# Altium project SimpleWatch.PrjPCB
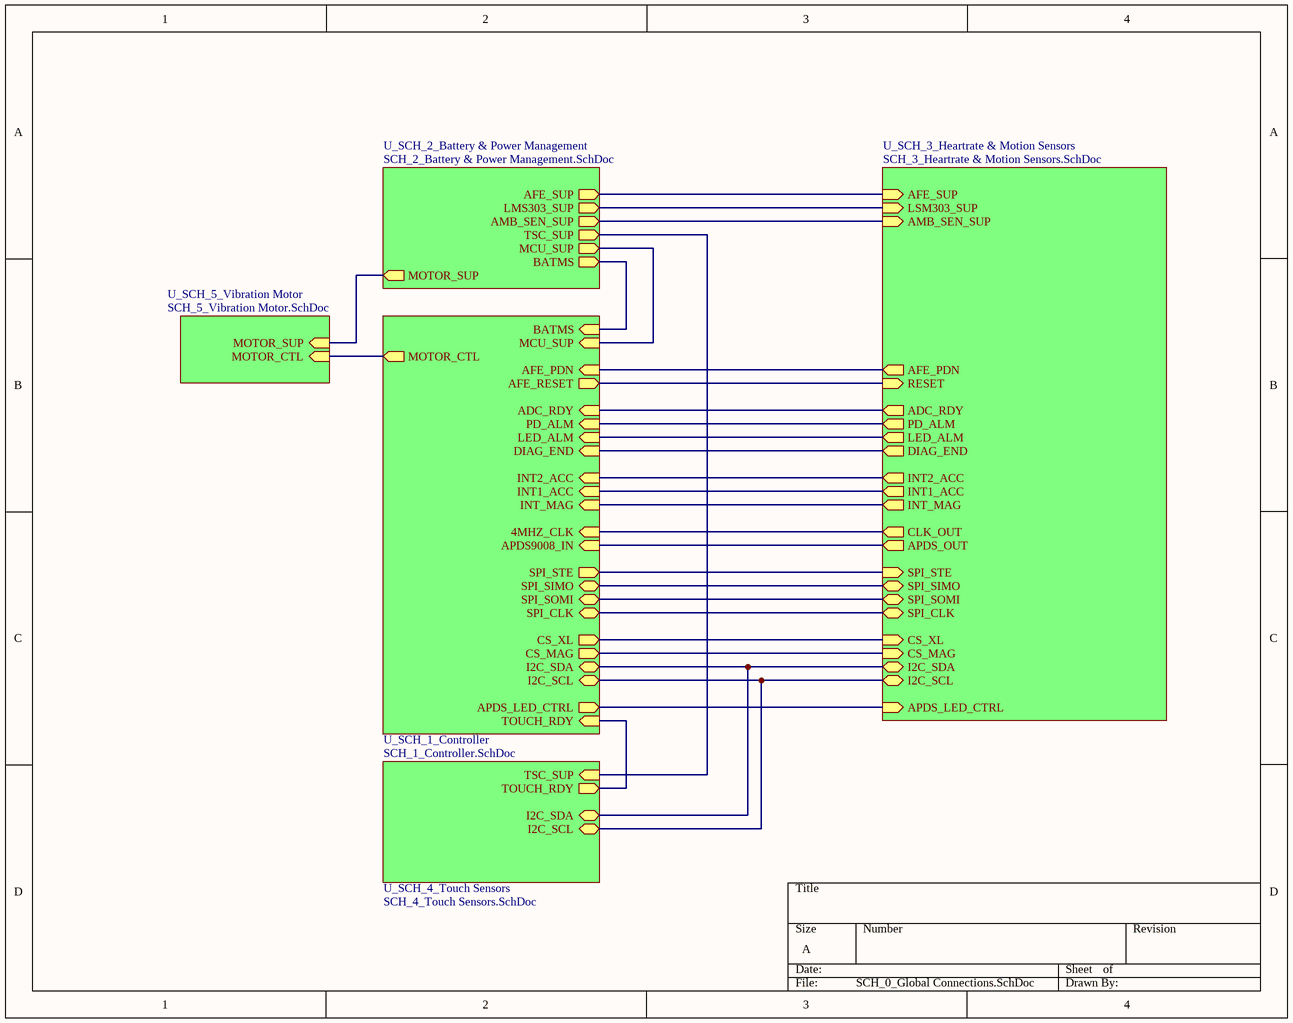
[diagram p0: SCH_0_Global Connections.SchDoc]
6 sheets, 125 parts. Net scope: hierarchical (ports join the sheet entries above them; power ports are global).
Board file: Simple Watch Development Board.PcbDoc
Sheets:
  SCH_0_Global Connections.SchDoc
    U_SCH_3_Heartrate & Motion Sensors = SCH_3_Heartrate & Motion Sensors.SchDoc
    U_SCH_2_Battery & Power Management = SCH_2_Battery & Power Management.SchDoc
    U_SCH_1_Controller = SCH_1_Controller.SchDoc
    U_SCH_4_Touch Sensors = SCH_4_Touch Sensors.SchDoc
    U_SCH_5_Vibration Motor = SCH_5_Vibration Motor.SchDoc

## Sheet SCH_0_Global Connections.SchDoc
size A

### Sub-sheets
U_SCH_1_Controller = SCH_1_Controller.SchDoc: MCU_SUP (in), ADC_RDY (in), PD_ALM (in), LED_ALM (in), DIAG_END (in), AFE_RESET (out), INT_MAG (in), INT2_ACC (in), INT1_ACC (in), 4MHZ_CLK (in), APDS9008_IN (in), SPI_STE (out), SPI_SIMO (bidir), SPI_SOMI (bidir), SPI_CLK (bidir), CS_XL (out), CS_MAG (out), I2C_SDA (bidir), I2C_SCL (bidir), BATMS (in), TOUCH_RDY (in), APDS_LED_CTRL (out), AFE_PDN (in), MOTOR_CTL (out)
U_SCH_2_Battery & Power Management = SCH_2_Battery & Power Management.SchDoc: LMS303_SUP (out), AMB_SEN_SUP (out), MCU_SUP (out), BATMS (out), AFE_SUP (out), MOTOR_SUP (out), TSC_SUP (out)
U_SCH_3_Heartrate & Motion Sensors = SCH_3_Heartrate & Motion Sensors.SchDoc: CLK_OUT (out), RESET (in), ADC_RDY (out), SPI_STE (in), SPI_SIMO (bidir), SPI_SOMI (bidir), SPI_CLK (bidir), PD_ALM (out), LED_ALM (out), DIAG_END (out), INT_MAG (out), INT2_ACC (out), INT1_ACC (out), CS_XL (in), CS_MAG (in), I2C_SDA (bidir), I2C_SCL (bidir), APDS_OUT (out), LSM303_SUP (in), AMB_SEN_SUP (in), AFE_SUP (in), APDS_LED_CTRL (in), AFE_PDN (out)
U_SCH_4_Touch Sensors = SCH_4_Touch Sensors.SchDoc: TOUCH_RDY (out), I2C_SDA (bidir), I2C_SCL (bidir), TSC_SUP (in)
U_SCH_5_Vibration Motor = SCH_5_Vibration Motor.SchDoc: MOTOR_CTL (in), MOTOR_SUP (in)

### Nets
APDS_SUP: sheet U_SCH_3_Heartrate & Motion Sensors/AMB_SEN_SUP, sheet U_SCH_2_Battery & Power Management/AMB_SEN_SUP
LED_DRV_SUP: sheet U_SCH_3_Heartrate & Motion Sensors/AFE_SUP, sheet U_SCH_2_Battery & Power Management/AFE_SUP
LSM303_SUP: sheet U_SCH_3_Heartrate & Motion Sensors/LSM303_SUP, sheet U_SCH_2_Battery & Power Management/LMS303_SUP
MCU_SUP: sheet U_SCH_2_Battery & Power Management/MCU_SUP, sheet U_SCH_1_Controller/MCU_SUP
AFE_PDN: sheet U_SCH_3_Heartrate & Motion Sensors/AFE_PDN, sheet U_SCH_1_Controller/AFE_PDN
AFE_RST: sheet U_SCH_3_Heartrate & Motion Sensors/RESET, sheet U_SCH_1_Controller/AFE_RESET
APDS_LED: sheet U_SCH_3_Heartrate & Motion Sensors/APDS_LED_CTRL, sheet U_SCH_1_Controller/APDS_LED_CTRL
CS_AFE: sheet U_SCH_3_Heartrate & Motion Sensors/SPI_STE, sheet U_SCH_1_Controller/SPI_STE
CS_MAG: sheet U_SCH_3_Heartrate & Motion Sensors/CS_MAG, sheet U_SCH_1_Controller/CS_MAG
CS_XL: sheet U_SCH_3_Heartrate & Motion Sensors/CS_XL, sheet U_SCH_1_Controller/CS_XL
I2C1_SCL: sheet U_SCH_3_Heartrate & Motion Sensors/I2C_SCL, sheet U_SCH_1_Controller/I2C_SCL, sheet U_SCH_4_Touch Sensors/I2C_SCL
I2C1_SDA: sheet U_SCH_3_Heartrate & Motion Sensors/I2C_SDA, sheet U_SCH_1_Controller/I2C_SDA, sheet U_SCH_4_Touch Sensors/I2C_SDA
INT1_ACC: sheet U_SCH_3_Heartrate & Motion Sensors/INT1_ACC, sheet U_SCH_1_Controller/INT1_ACC
INT2_ACC: sheet U_SCH_3_Heartrate & Motion Sensors/INT2_ACC, sheet U_SCH_1_Controller/INT2_ACC
MOTOR: sheet U_SCH_1_Controller/MOTOR_CTL, sheet U_SCH_5_Vibration Motor/MOTOR_CTL
MOTOR_SUP: sheet U_SCH_2_Battery & Power Management/MOTOR_SUP, sheet U_SCH_5_Vibration Motor/MOTOR_SUP
OPAMP1_VINP: sheet U_SCH_3_Heartrate & Motion Sensors/APDS_OUT, sheet U_SCH_1_Controller/APDS9008_IN
SPI1_MISO: sheet U_SCH_3_Heartrate & Motion Sensors/SPI_SOMI, sheet U_SCH_1_Controller/SPI_SOMI
SPI1_MOSI: sheet U_SCH_3_Heartrate & Motion Sensors/SPI_SIMO, sheet U_SCH_1_Controller/SPI_SIMO
SPI1_SCK: sheet U_SCH_3_Heartrate & Motion Sensors/SPI_CLK, sheet U_SCH_1_Controller/SPI_CLK
TOUCH_RDY: sheet U_SCH_1_Controller/TOUCH_RDY, sheet U_SCH_4_Touch Sensors/TOUCH_RDY
TSC_SUP: sheet U_SCH_2_Battery & Power Management/TSC_SUP, sheet U_SCH_4_Touch Sensors/TSC_SUP
NetR11_1: sheet U_SCH_3_Heartrate & Motion Sensors/CLK_OUT, sheet U_SCH_1_Controller/4MHZ_CLK
NetR12_1: sheet U_SCH_2_Battery & Power Management/BATMS, sheet U_SCH_1_Controller/BATMS
NetU11_4: sheet U_SCH_3_Heartrate & Motion Sensors/DIAG_END, sheet U_SCH_1_Controller/DIAG_END
NetU11_14: sheet U_SCH_3_Heartrate & Motion Sensors/ADC_RDY, sheet U_SCH_1_Controller/ADC_RDY
NetU11_21: sheet U_SCH_3_Heartrate & Motion Sensors/PD_ALM, sheet U_SCH_1_Controller/PD_ALM
NetU11_22: sheet U_SCH_3_Heartrate & Motion Sensors/LED_ALM, sheet U_SCH_1_Controller/LED_ALM
NetU11_38: sheet U_SCH_3_Heartrate & Motion Sensors/INT_MAG, sheet U_SCH_1_Controller/INT_MAG

## Sheet SCH_3_Heartrate & Motion Sensors.SchDoc
size B
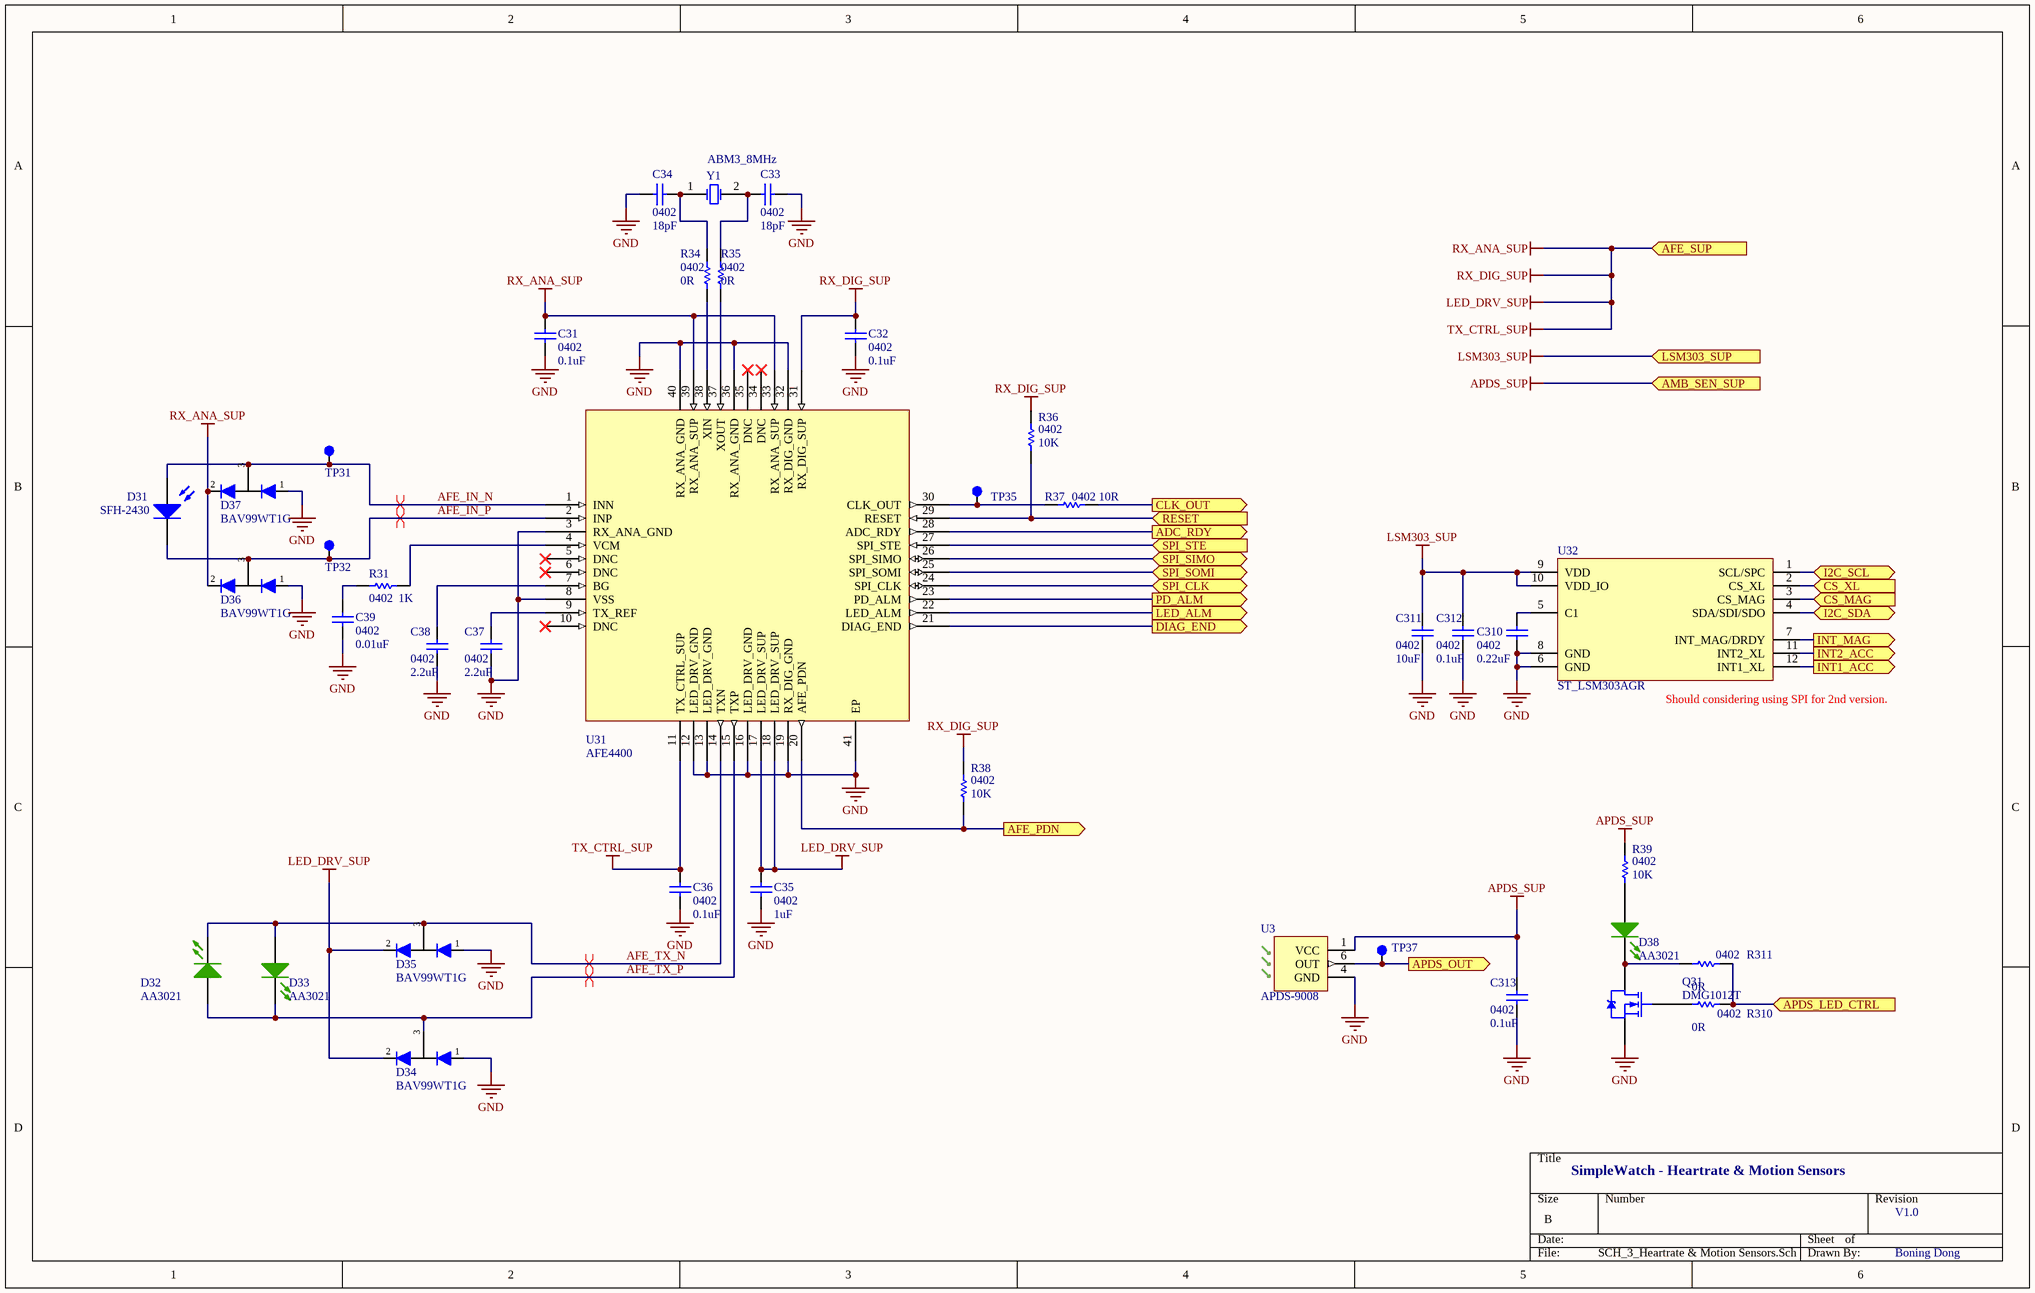
[diagram p1: SCH_3_Heartrate & Motion Sensors.SchDoc]

### Parts
C31  0402  value 0.1uF  [CAPC1005X07N]
C32  0402  value 0.1uF  [CAPC1005X07N]
C33  0402  value 18pF  [CAPC1005X07N]
C34  0402  value 18pF  [CAPC1005X07N]
C35  0402  value 1uF  [CAPC1005X07N]
C36  0402  value 0.1uF  [CAPC1005X07N]
C37  0402  value 2.2uF  [CAPC1005X07N]
C38  0402  value 2.2uF  [CAPC1005X07N]
C39  0402  value 0.01uF  [CAPC1005X07N]
C310  0402  value 0.22uF  [CAPC1005X07N]
C311  0402  value 10uF  [CAPC1005X07N]
C312  0402  value 0.1uF  [CAPC1005X07N]
C313  0402  value 0.1uF  [CAPC1005X07N]
D31  SFH-2430  [PHOTODIODE_OSRAM_SFH_2430]
D32  AA3021  [LED_KINGBRIGHT_AA3021]
D33  AA3021  [LED_KINGBRIGHT_AA3021]
D34  BAV99WT1G  [SOT65P200X125X90-3N]
D35  BAV99WT1G  [SOT65P200X125X90-3N]
D36  BAV99WT1G  [SOT65P200X125X90-3N]
D37  BAV99WT1G  [SOT65P200X125X90-3N]
D38  AA3021  [LED_KINGBRIGHT_AA3021]
Q31  DMG1012T  [SOT65P200X125X95-3N]
R31  0402  value 1K  [RESC1005X04N]
R34  0402  value 0R  [RESC1005X04N]
R35  0402  value 0R  [RESC1005X04N]
R36  0402  value 10K  [RESC1005X04N]
R37  0402  value 10R  [RESC1005X04N]
R38  0402  value 10K  [RESC1005X04N]
R39  0402  value 10K  [RESC1005X04N]
R310  0402  value 0R  [RESC1005X04N]
R311  0402  value 0R  [RESC1005X04N]
TP31  TP  [TP100]  (value not drawn)
TP32  TP  [TP100]  (value not drawn)
TP35  TP  [TP100]  (value not drawn)
TP37  TP  [TP100]  (value not drawn)
U3  APDS-9008  [APDS-9008]
U31  AFE4400  [QFN50P600X600X100-40N_HS410]
U32  ST_LSM303AGR  [LGA12S50P4X4_200X200X100]
Y1  ABM3_8MHz  [ABRACON_ABM3]

### Ports
ADC_RDY (out), AFE_PDN (out), AFE_SUP (in), AMB_SEN_SUP (in), APDS_LED_CTRL (in), APDS_OUT (out), CLK_OUT (out), CS_MAG (in), CS_XL (in), DIAG_END (out), I2C_SCL (bidir), I2C_SDA (bidir), INT1_ACC (out), INT2_ACC (out), INT_MAG (out), LED_ALM (out), LSM303_SUP (in), PD_ALM (out), RESET (in), SPI_CLK (bidir), SPI_SIMO (bidir), SPI_SOMI (bidir), SPI_STE (in)

### Nets
APDS_SUP: C313.2 R39.2 U3.1(VCC) ; port AMB_SEN_SUP
GND: C31.1 C32.1 C33.1 C34.2 C35.1 C36.1 C37.1 C38.1 C39.1 C310.1 C311.1 C312.1 C313.1 D34.1(ANODE) D35.1(ANODE) D36.1(ANODE) D37.1(ANODE) Q31.2(S) U3.4(GND) U31.3(RX_ANA_GND) U31.8(VSS) U31.12(LED_DRV_GND) U31.13(LED_DRV_GND) U31.16(LED_DRV_GND) U31.19(RX_DIG_GND) U31.32(RX_DIG_GND) U31.36(RX_ANA_GND) U31.40(RX_ANA_GND) U31.41(EP) U32.6(GND) U32.8(GND)
LED_DRV_SUP: C31.2 C32.2 C35.2 C36.2 D34.2(ANODE) D35.2(ANODE) D36.2(ANODE) D37.2(ANODE) R36.2 R38.2 U31.11(TX_CTRL_SUP) U31.17(LED_DRV_SUP) U31.18(LED_DRV_SUP) U31.31(RX_DIG_SUP) U31.33(RX_ANA_SUP) U31.39(RX_ANA_SUP) ; port AFE_SUP  [also labelled RX_ANA_SUP, RX_DIG_SUP, TX_CTRL_SUP]
LSM303_SUP: C311.2 C312.2 U32.9(VDD) U32.10(VDD_IO) ; port LSM303_SUP
AFE_IN_N: D31.1(A) D37.3(ANODE) TP31.1 U31.1(INN)
AFE_IN_P: D31.2(K) D36.3(ANODE) TP32.1 U31.2(INP)
AFE_PDN: R38.1 U31.20(AFE_PDN) ; port AFE_PDN
AFE_RST: R36.1 U31.29(RESET) ; port RESET
AFE_TX_N: D32.2(K) D33.1(A) D35.3(ANODE) U31.14(TXN)
AFE_TX_P: D32.1(A) D33.2(K) D34.3(ANODE) U31.15(TXP)
APDS_LED: R310.1 R311.1 ; port APDS_LED_CTRL
CS_AFE: U31.27(SPI_STE) ; port SPI_STE
CS_MAG: U32.3(CS_MAG) ; port CS_MAG
CS_XL: U32.2(CS_XL) ; port CS_XL
I2C1_SCL: U32.1(SCL/SPC) ; port I2C_SCL
I2C1_SDA: U32.4(SDA/SDI/SDO) ; port I2C_SDA
INT1_ACC: U32.12(INT1_XL) ; port INT1_ACC
INT2_ACC: U32.11(INT2_XL) ; port INT2_ACC
OPAMP1_VINP: TP37.1 U3.6(OUT) ; port APDS_OUT
SPI1_MISO: U31.25(SPI_SOMI) ; port SPI_SOMI
SPI1_MOSI: U31.26(SPI_SIMO) ; port SPI_SIMO
SPI1_SCK: U31.24(SPI_CLK) ; port SPI_CLK
NetC33_2: C33.2 R35.2 Y1.2(OSC2)
NetC34_1: C34.1 R34.2 Y1.1(OSC1)
NetC37_2: C37.2 U31.9(TX_REF)
NetC38_2: C38.2 U31.7(BG)
NetC39_2: C39.2 R31.1
NetC310_2: C310.2 U32.5(C1)
NetD38_1: D38.1(A) R39.1
NetD38_2: D38.2(K) Q31.3(D) R311.2
NetQ31_1: Q31.1(G) R310.2
NetR11_1: R37.1 ; port CLK_OUT
NetR31_2: R31.2 U31.4(VCM)
NetR34_1: R34.1 U31.38(XIN)
NetR35_1: R35.1 U31.37(XOUT)
NetR37_2: R37.2 TP35.1 U31.30(CLK_OUT)
NetU11_4: U31.21(DIAG_END) ; port DIAG_END
NetU11_14: U31.28(ADC_RDY) ; port ADC_RDY
NetU11_21: U31.23(PD_ALM) ; port PD_ALM
NetU11_22: U31.22(LED_ALM) ; port LED_ALM
NetU11_38: U32.7(INT_MAG/DRDY) ; port INT_MAG

Not connected (* = marked no-connect by the designer): U31 5(DNC)* 6(DNC)* 10(DNC)* 34(DNC)* 35(DNC)*

### Layout directives
differential pair; net class DIFF: AFE_IN_N, AFE_IN_P, AFE_TX_N, AFE_TX_P

### Notes on the sheet
- (near U32) Should considering using SPI for 2nd version.
- SimpleWatch - Heartrate & Motion Sensors
- V1.0
- Boning Dong

### Library data of the parts
C31-C39 C310-C313 = Cap: Capacitor; Published: 8-Jun-2000; LatestRevisionDate: 17-Jul-2002; LatestRevisionNote: Re-released for DXP Platform.; PackageReference: RAD-0.3; Publisher: Altium Limited; PackageDescription: Radial Cap, Thru-Hole; 2 Leads; 0.3 in Pin Spacing
D31 = Photo Sen: Photosensitive Diode; Published: 24-Mar-1999; LatestRevisionDate: 17-Jul-2002; LatestRevisionNote: Re-released for DXP Platform.; PackageReference: PIN2; Publisher: Altium Limited
D32 D33 D38 = LED_GREEN: General Green LED
D34-D37 = BAV99WT1: DIODE ARRAY GP 100V 215MA SC70-3
Q31 = DMG1012T-7: MOSFET N-CH 20V 630MA SOT-523; Manufacturer: Diodes; Rds On Max: 400mR; Input Capacitance: 60.67pF; Max Power Dissipation: 280mW; Rise Time: 7.4ns; Fall Time: 12.3ns; Turn-On Delay Time: 5.1ns; Turn-Off Delay Time: 26.7ns; Gate to Source Voltage (Vgs): 6V; Number of Elements: 1; Drain to Source Resistance: 300mR; Threshold Voltage: 1V; Element Configuration: Single; FET Type: 1 N-Channel; Supplier 1: Digi-Key; Manufacturer Part Number: DMG1012T-7; Stock 1: 0; Pricing 1: 1=0.36, 10=0.326, 100=0.1824, 500=0.0977, 1000=0.0665 (USD); Mount: Surface Mount; Case/Package: SOT-523; Number of Pins: 3; Weight: 7.1E-05oz; Contact Plating: Tin,Matte; Min Operating Temperature: -55°C; Max Operating Temperature: 150°C; Continuous Drain Current (ID): 630mA; Packaging: Tape and Reel; Drain to Source Voltage (Vdss): 20V; Package Quantity: 3000; Number of Channels: 1; Drain to Source Breakdown Voltage: 20V; Power Dissipation: 280mW; On-State Resistance: 400MR; Length: 1.7mm; Height: 0.8mm; Width: 0.85mm; Radiation Hardening: No; REACH SVHC: No SVHC; Lead Free: Lead Free; ComponentLink1URL: https://datasheet.ciiva.com/934/ds31783-934512.pdf; ComponentLink1Description: https://datasheet.ciiva.com/934/ds31783-934512.pdf; ComponentLink2URL: https://datasheet.ciiva.com/4442/ds31783-44973-4442944.pdf; ComponentLink2Description: https://datasheet.ciiva.com/4442/ds31783-44973-4442944.pdf; ComponentLink3URL: https://datasheet.ciiva.com/11174/ds31783-11174965.pdf; ComponentLink3Description: https://datasheet.ciiva.com/11174/ds31783-11174965.pdf; ComponentLink4URL: https://datasheet.ciiva.com/17324/ds31783-17324010.pdf; ComponentLink4Description: https://datasheet.ciiva.com/17324/ds31783-17324010.pdf; ComponentLink5URL: https://datasheet.ciiva.com/6383/ds31783-6383803.pdf; ComponentLink5Description: https://datasheet.ciiva.com/6383/ds31783-6383803.pdf; ComponentLink6URL: https://datasheet.ciiva.com/934/ds31783-934511.pdf; ComponentLink6Description: https://datasheet.ciiva.com/934/ds31783-934511.pdf
R31 R34-R39 R310 R311 = Res1: Resistor; Published: 8-Jun-2000; LatestRevisionDate: 17-Jul-2002; LatestRevisionNote: Re-released for DXP Platform.; PackageReference: AXIAL-0.3; Publisher: Altium Limited; PackageDescription: Axial Device, Thru-Hole; 2 Leads; 0.3 in Pin Spacing
TP31 TP32 TP35 TP37 = TP_A: Test Point dot type
U3 = APDS-9008: Optical Sensor Ambient 565nm Current 6-SMD, No Lead
U31 = AFE4400: Integrated Analog Front End (AFE) for Heart-Rate Monitors and Low-Cost Pulse Oximeters
U32 = ST_LSM303AGR: Accelerometer, Magnetometer, Temperature, 3 Axis Sensor I²C, SPI Output
Y1 = XTAL: Crystal Oscillator; Published: 8-Jun-2000; LatestRevisionDate: 17-Jul-2002; LatestRevisionNote: Re-released for DXP Platform.; PackageReference: R38; Publisher: Altium Limited; PackageDescription: Crystal, Thru-Hole; 2 Leads; Body 3.1 x 8.2 mm (Dia.xH)

## Sheet SCH_2_Battery & Power Management.SchDoc
size A
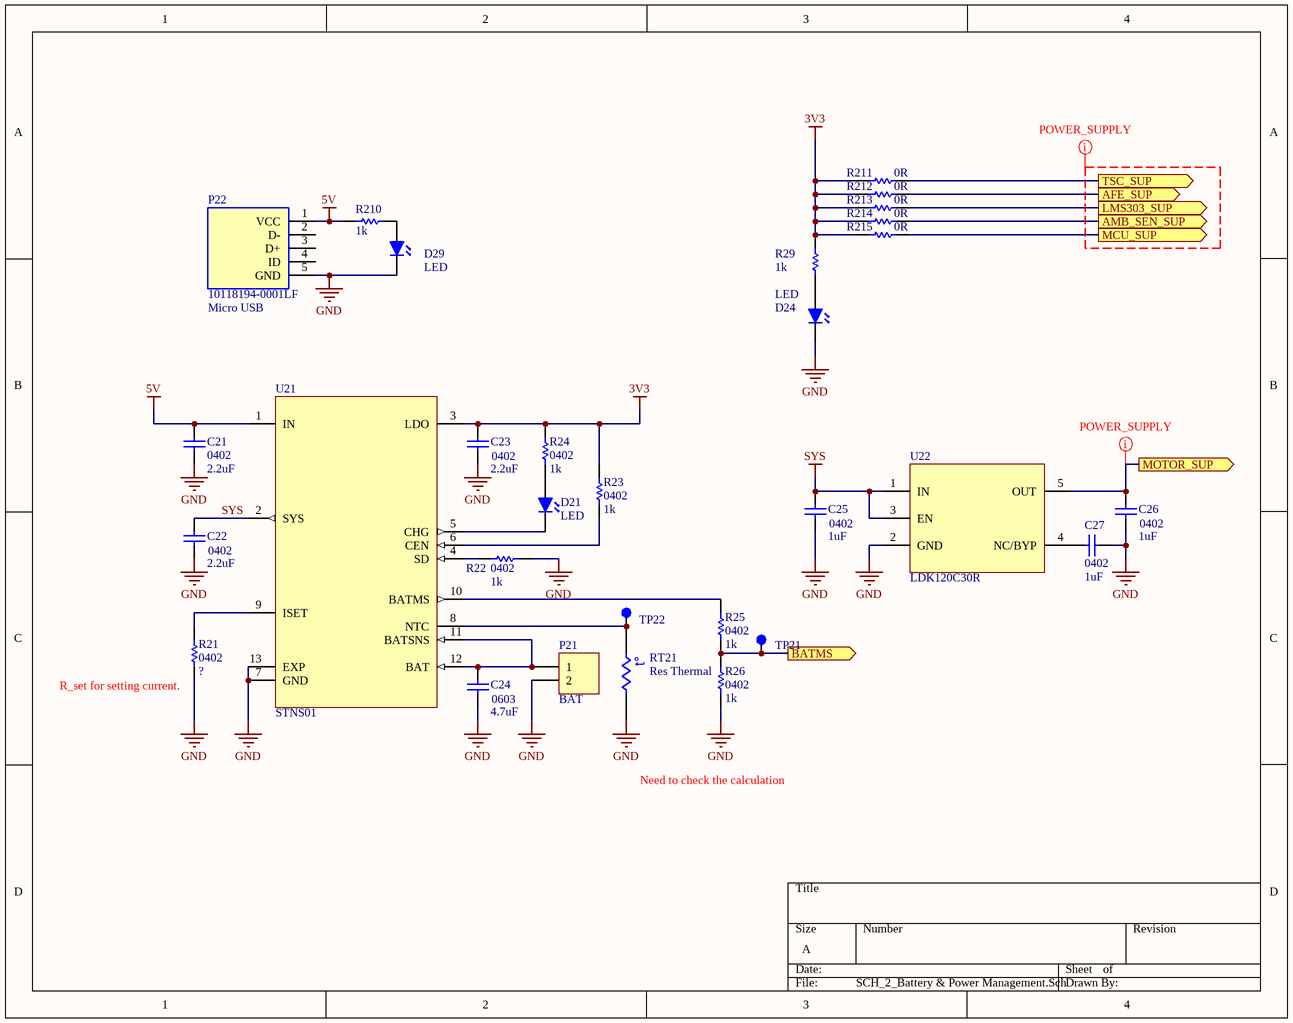
[diagram p2: SCH_2_Battery & Power Management.SchDoc]

### Parts
C21  0402  value 2.2uF  [CAPC1005X07N]
C22  0402  value 2.2uF  [CAPC1005X07N]
C23  0402  value 2.2uF  [CAPC1005X07N]
C24  0603  value 4.7uF  [CAPC1608X10N]
C25  0402  value 1uF  [CAPC1005X07N]
C26  0402  value 1uF  [CAPC1005X07N]
C27  0402  value 1uF  [CAPC1005X07N]
D21  LED  [LED_1005X05N]
D24  LED  [LED_1005X05N]
D29  LED  [LED_1005X05N]
P21  BAT  [HDR1X2]
P22  Micro USB  Manufacture P/N: 10118194-0001LF  [USB_Mirco_Amphenol FCI_10118194]
R21  0402  [RESC1005X04N]
R22  0402  value 1k  [RESC1005X04N]
R23  0402  value 1k  [RESC1005X04N]
R24  0402  value 1k  [RESC1005X04N]
R25  0402  value 1k  [RESC1005X04N]
R26  0402  value 1k  [RESC1005X04N]
R29  value 1k  [RESC1005X04N]  (hidden comment: 0402)
R210  value 1k  [RESC1005X04N]  (hidden comment: 0402)
R211  value 0R  [RESC1005X04N]  (hidden comment: 0402)
R212  value 0R  [RESC1005X04N]  (hidden comment: 0402)
R213  value 0R  [RESC1005X04N]  (hidden comment: 0402)
R214  value 0R  [RESC1005X04N]  (hidden comment: 0402)
R215  value 0R  [RESC1005X04N]  (hidden comment: 0402)
RT21  Res Thermal  [MHDR1X2]
TP21  TP  [TP100]  (value not drawn)
TP22  TP  [TP100]  (value not drawn)
U21  STNS01  [DFN45P300X300X80-12N_HS200X120]
U22  LDK120C30R  [SOT65P210X110-5L]

### Ports
AFE_SUP (out), AMB_SEN_SUP (out), BATMS (out), LMS303_SUP (out), MCU_SUP (out), MOTOR_SUP (out), TSC_SUP (out)

### Nets
3V3: C23.2 R23.1 R24.1 R29.1 R211.1 R212.1 R213.1 R214.1 R215.1 U21.3(LDO)
5V: C21.2 P22.1(VCC) R210.1 U21.1(IN)
APDS_SUP: R214.2 ; port AMB_SEN_SUP
GND: C21.1 C22.1 C23.1 C24.1 C25.1 C26.1 C27.1 D24.2(-) D29.2(-) P21.2 P22.5(GND) R21.1 R22.1 R26.2 RT21.2 U21.7(GND) U21.13(EXP) U22.2(GND)
LED_DRV_SUP: R212.2 ; port AFE_SUP
LSM303_SUP: R213.2 ; port LMS303_SUP
MCU_SUP: R215.2 ; port MCU_SUP
SYS: C22.2 C25.2 U21.2(SYS) U22.1(IN) U22.3(EN)
MOTOR_SUP: C26.2 U22.5(OUT) ; port MOTOR_SUP
TSC_SUP: R211.2 ; port TSC_SUP
NetC24_2: C24.2 P21.1 U21.11(BATSNS) U21.12(BAT)
NetC27_2: C27.2 U22.4(NC/BYP)
NetD21_1: D21.1(+) R24.2
NetD21_2: D21.2(-) U21.5(CHG)
NetD24_1: D24.1(+) R29.2
NetD29_1: D29.1(+) R210.2
NetR12_1: R25.2 R26.1 TP21.1 ; port BATMS
NetR21_2: R21.2 U21.9(ISET)
NetR22_2: R22.2 U21.4(SD)
NetR23_2: R23.2 U21.6(CEN)
NetR25_1: R25.1 U21.10(BATMS)
NetRT21_1: RT21.1 TP22.1 U21.8(NTC)

Not connected (* = marked no-connect by the designer): P22 2(D-) 3(D+) 4(ID)

### Layout directives
net class POWER_SUPPLY: (no net found under the mark), MOTOR_SUP

### Notes on the sheet
- (near R21) R_set for setting current.
- Need to check the calculation
- (in symbol Res Thermal) t°

### Library data of the parts
C21-C27 = Cap: Capacitor; Published: 8-Jun-2000; LatestRevisionDate: 17-Jul-2002; LatestRevisionNote: Re-released for DXP Platform.; PackageReference: RAD-0.3; Publisher: Altium Limited; PackageDescription: Radial Cap, Thru-Hole; 2 Leads; 0.3 in Pin Spacing
D21 D24 D29 = LED: General LED
P21 = MHDR1X2: Li-Poly Battery; LatestRevisionDate: 17-Jul-2002; LatestRevisionNote: Re-released for DXP Platform.; Publisher: Altium Limited
P22 = CONN_MICRO_USB: General  Micro USB
R21-R26 R29 R210-R215 = Res1: Resistor; Published: 8-Jun-2000; LatestRevisionDate: 17-Jul-2002; LatestRevisionNote: Re-released for DXP Platform.; PackageReference: AXIAL-0.3; Publisher: Altium Limited; PackageDescription: Axial Device, Thru-Hole; 2 Leads; 0.3 in Pin Spacing
  R21: Value: ?
RT21 = Res Thermal: Thermistor; Published: 24-Mar-1999; LatestRevisionDate: 29-May-2009; LatestRevisionNote: IPC-7351 Footprint Added.; PackageVersion: Mar-2003; PackageReference: 6-0805; Publisher: Altium Limited; PackageDescription: Chip Resistor 0805 Case Size; Code_IPC: RESC2012
TP21 TP22 = TP_A: Test Point dot type
U21 = STNS01: Battery Charger Li-Ion 200mA with LDO 100mA 12-Pin DFN EP T/R
U22 = LDK120C30R: IC REG LDO 3V 0.2A SOT323-5; Manufacturer: STMicroelectronics; Max Input Voltage: 5.5V; Output Current: 200mA; Number of Outputs: 1; Min Input Voltage: 1.9V; Dropout Voltage: 300mV; Operating Supply Current: 50uA; Polarity: Positive; Quiescent Current: 60uA; Accuracy: 2%; Manufacturer Part Number: LDK120C30R; Mount: Surface Mount; Case/Package: SOT-323-5; Number of Pins: 5; Min Operating Temperature: -40°C; Max Operating Temperature: 125°C; Output Voltage: 3V; Packaging: Tape and Reel; Package Quantity: 1; Max Output Current: 200mA; Number of Regulators: 1; Tolerance: 2%; Lead Free: Lead Free; ComponentLink1URL: https://datasheet.ciiva.com/6591/dm00070790-6591173.pdf; ComponentLink1Description: https://datasheet.ciiva.com/6591/dm00070790-6591173.pdf; ComponentLink2URL: https://datasheet.ciiva.com/6591/dm00070790-6591175.pdf; ComponentLink2Description: https://datasheet.ciiva.com/6591/dm00070790-6591175.pdf; ComponentLink3URL: https://datasheet.ciiva.com/6591/dm00070790-6591177.pdf; ComponentLink3Description: https://datasheet.ciiva.com/6591/dm00070790-6591177.pdf; ComponentLink4URL: https://datasheet.ciiva.com/8228/dm00070790-8228636.pdf; ComponentLink4Description: https://datasheet.ciiva.com/8228/dm00070790-8228636.pdf; ComponentLink5URL: https://datasheet.ciiva.com/41439/001184872-da-01-en-ic-reg-ldo-3v-0-ldk120c30r-sot-323-5-stm-41439977.pdf; ComponentLink5Description: https://datasheet.ciiva.com/41439/001184872-da-01-en-ic-reg-ldo-3v-0-ldk120c30r-sot-323-5-stm-41439977.pdf

## Sheet SCH_1_Controller.SchDoc
size A3
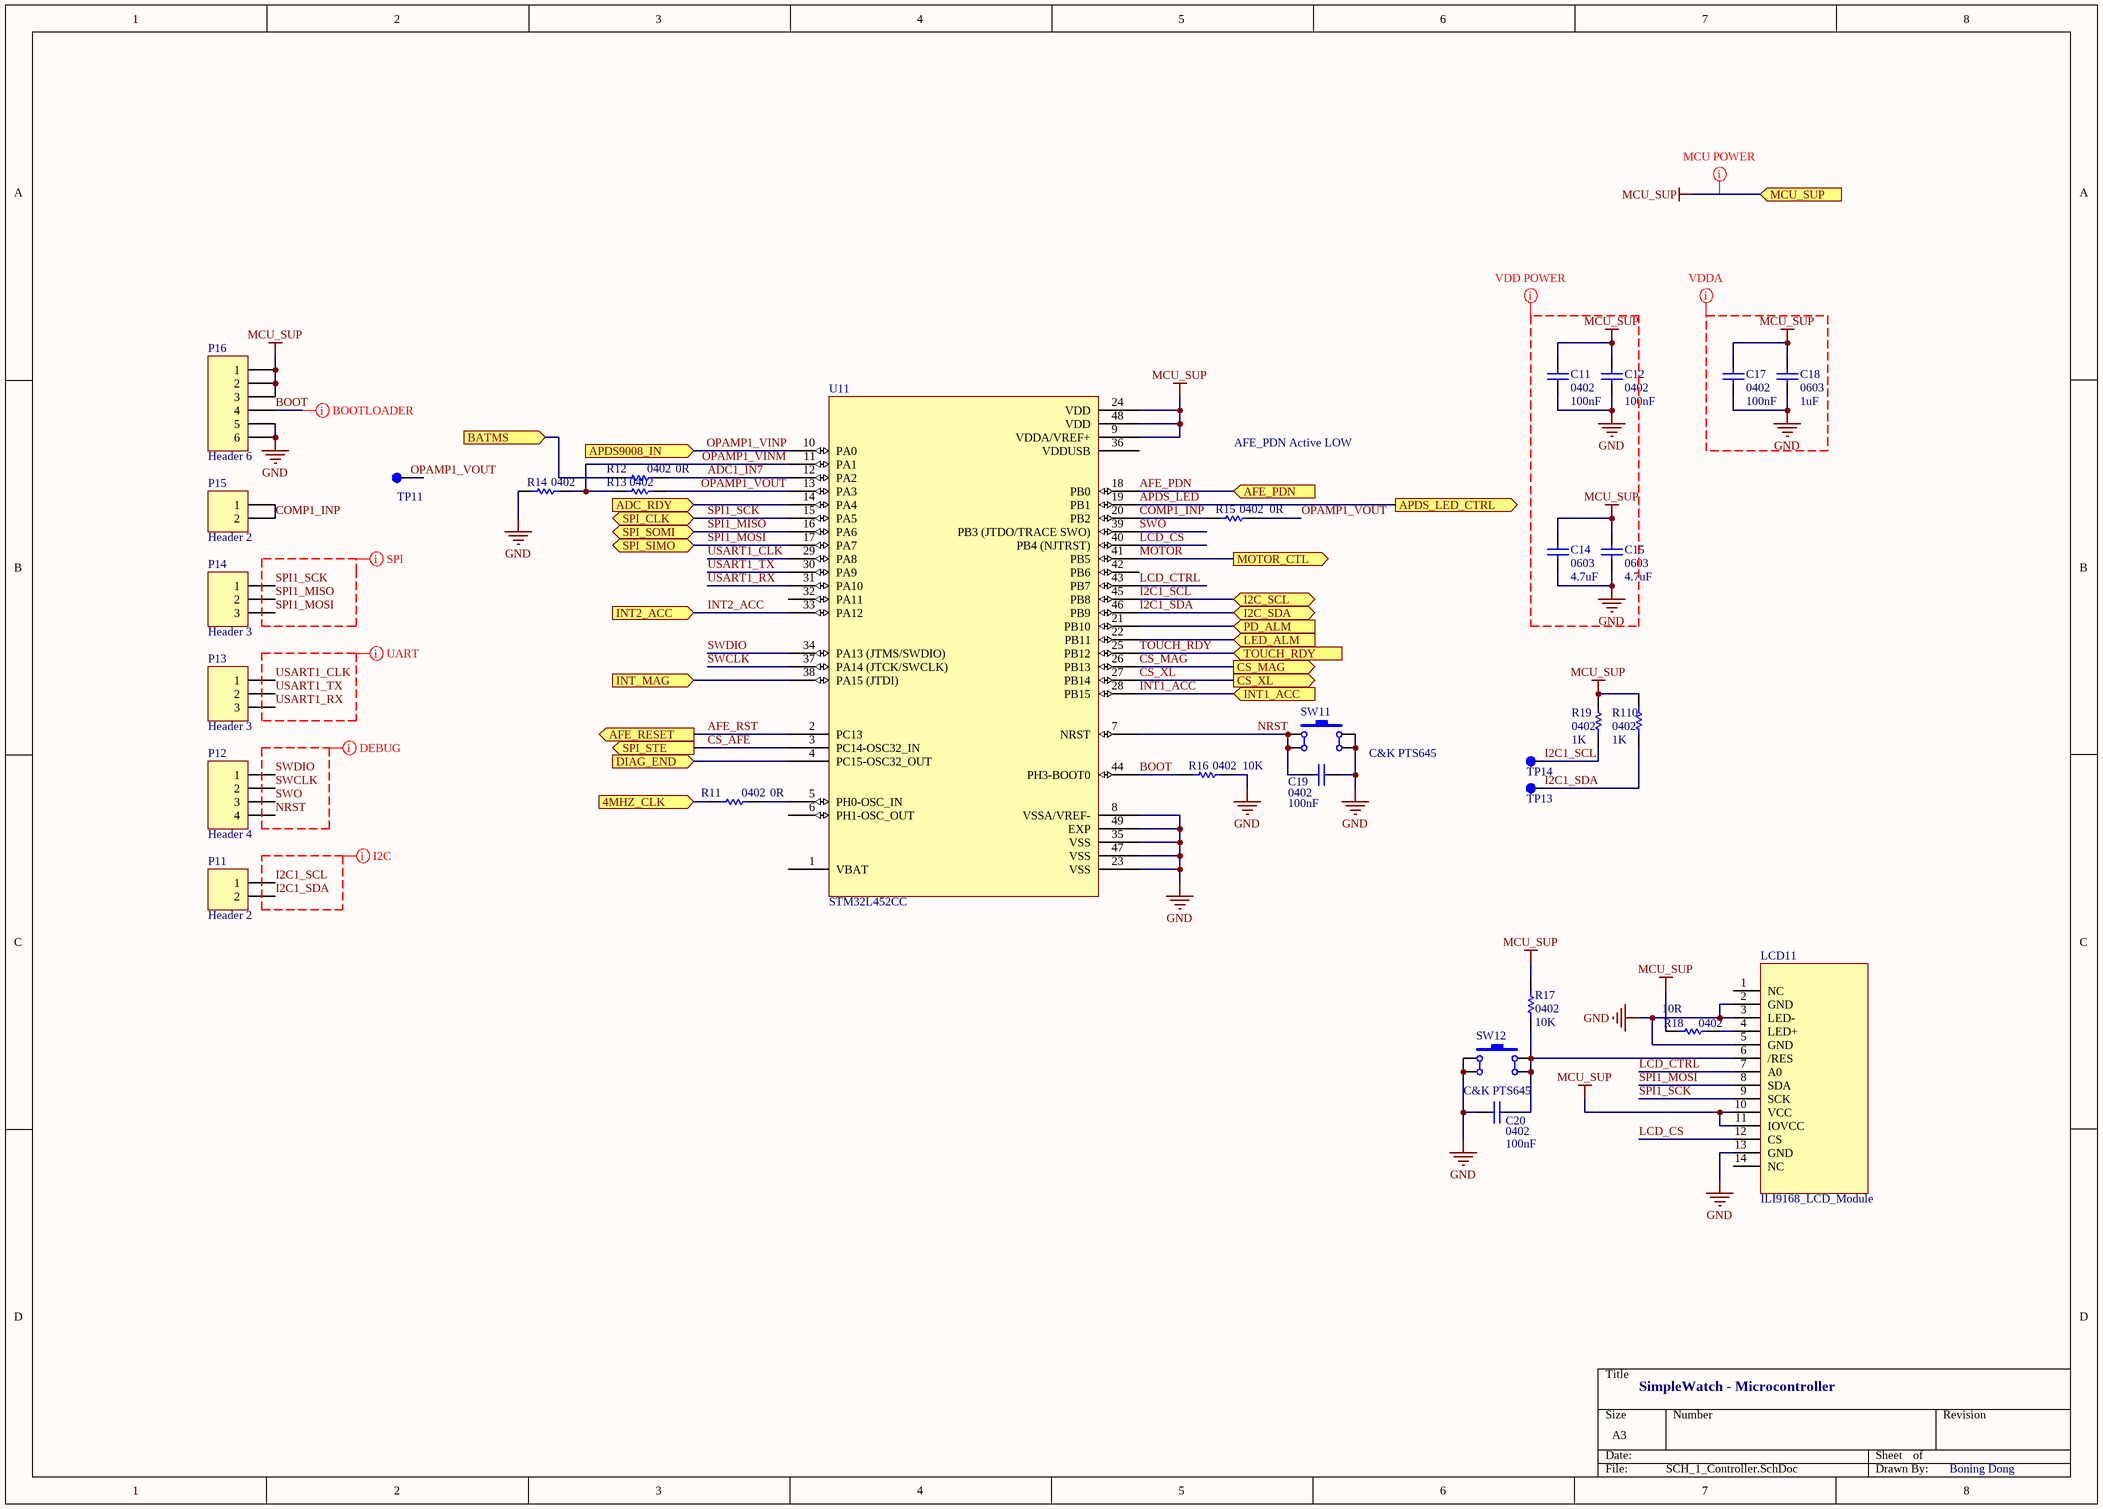
[diagram p3: SCH_1_Controller.SchDoc]

### Parts
C11  0402  value 100nF  [CAPC1005X06N]
C12  0402  value 100nF  [CAPC1005X06N]
C14  0603  value 4.7uF  [CAPC1608X09N]
C15  0603  value 4.7uF  [CAPC1608X09N]
C17  0402  value 100nF  [CAPC1005X06N]
C18  0603  value 1uF  [CAPC1608X09N]
C19  0402  value 100nF  [CAPC1005X06N]
C20  0402  value 100nF  [CAPC1005X06N]
LCD11  ILI9168_LCD_Module  [LCD_SMT_128X128]
P11  Header 2  [HDR1X2]
P12  Header 4  [HDR1X4]
P13  Header 3  [HDR1X3]
P14  Header 3  [HDR1X3]
P15  Header 2  [HDR1X2]
P16  Header 6  [HDR1X6]
R11  0402  value 0R  [RESC1005X04N]
R12  0402  value 0R  [RESC1005X04N]
R13  0402  [RESC1005X04N]
R14  0402  [RESC1005X04N]
R15  0402  value 0R  [RESC1005X04N]
R16  0402  value 10K  [RESC1005X04N]
R17  0402  value 10K  [RESC1005X04N]
R18  0402  value 10R  [RESC1005X04N]
R19  0402  value 1K  [RESC1005X04N]
R110  0402  value 1K  [RESC1005X04N]
SW11  C&K PTS645  [C&K_PTS645_SMT]
SW12  C&K PTS645  [C&K_PTS645_SMT]
TP11  TP  [TP100]  (value not drawn)
TP13  TP  [TP100]  (value not drawn)
TP14  TP  [TP100]  (value not drawn)
U11  STM32L452CC  [QFN50P700X700X60-48N_HS550X550]

### Ports
4MHZ_CLK (in), ADC_RDY (in), AFE_PDN (in), AFE_RESET (out), APDS9008_IN (in), APDS_LED_CTRL (out), BATMS (in), CS_MAG (out), CS_XL (out), DIAG_END (in), I2C_SCL (bidir), I2C_SDA (bidir), INT1_ACC (in), INT2_ACC (in), INT_MAG (in), LED_ALM (in), MCU_SUP (in), MOTOR_CTL (out), PD_ALM (in), SPI_CLK (bidir), SPI_SIMO (bidir), SPI_SOMI (bidir), SPI_STE (out), TOUCH_RDY (in)

### Nets
GND: C11.1 C12.1 C14.1 C15.1 C17.1 C18.1 C19.1 C20.2 LCD11.2(GND) LCD11.3(LED-) LCD11.5(GND) LCD11.13(GND) P16.5 P16.6 R14.1 R16.2 SW11.3 SW11.4 SW12.1 SW12.2 U11.8(VSSA/VREF-) U11.23(VSS) U11.35(VSS) U11.47(VSS) U11.49(EXP)
MCU_SUP: C11.2 C12.2 C14.2 C15.2 C17.2 C18.2 LCD11.10(VCC) LCD11.11(IOVCC) P16.1 P16.2 P16.3 R17.2 R18.2 R19.1 R110.1 U11.9(VDDA/VREF+) U11.24(VDD) U11.48(VDD) ; port MCU_SUP
ADC1_IN7: R12.2 U11.12(PA2)
AFE_PDN: U11.18(PB0) ; port AFE_PDN
AFE_RST: U11.2(PC13) ; port AFE_RESET
APDS_LED: U11.19(PB1) ; port APDS_LED_CTRL
BOOT: P16.4 R16.1 U11.44(PH3-BOOT0)
COMP1_INP: P15.1 P15.2 R15.1 U11.20(PB2)
CS_AFE: U11.3(PC14-OSC32_IN) ; port SPI_STE
CS_MAG: U11.26(PB13) ; port CS_MAG
CS_XL: U11.27(PB14) ; port CS_XL
I2C1_SCL: P11.1 R19.2 TP14.1 U11.45(PB8) ; port I2C_SCL
I2C1_SDA: P11.2 R110.2 TP13.1 U11.46(PB9) ; port I2C_SDA
INT1_ACC: U11.28(PB15) ; port INT1_ACC
INT2_ACC: U11.33(PA12) ; port INT2_ACC
LCD_CS: LCD11.12(CS) U11.40(PB4_(NJTRST))
LCD_CTRL: LCD11.7(A0) U11.43(PB7)
MOTOR: U11.41(PB5) ; port MOTOR_CTL
NRST: C19.2 P12.4 SW11.1 SW11.2 U11.7(NRST)
OPAMP1_VINM: R13.1 R14.2 U11.11(PA1)
OPAMP1_VINP: U11.10(PA0) ; port APDS9008_IN
OPAMP1_VOUT: R13.2 R15.2 TP11.1 U11.13(PA3)
SPI1_MISO: P14.2 U11.16(PA6) ; port SPI_SOMI
SPI1_MOSI: LCD11.8(SDA) P14.3 U11.17(PA7) ; port SPI_SIMO
SPI1_SCK: LCD11.9(SCK) P14.1 U11.15(PA5) ; port SPI_CLK
SWCLK: P12.2 U11.37(PA14_(JTCK/SWCLK))
SWDIO: P12.1 U11.34(PA13_(JTMS/SWDIO))
SWO: P12.3 U11.39(PB3_(JTDO/TRACE_SWO))
TOUCH_RDY: U11.25(PB12) ; port TOUCH_RDY
USART1_CLK: P13.1 U11.29(PA8)
USART1_RX: P13.3 U11.31(PA10)
USART1_TX: P13.2 U11.30(PA9)
NetC20_1: C20.1 LCD11.6(/RES) R17.1 SW12.3 SW12.4
NetLCD11_4: LCD11.4(LED+) R18.1
NetR11_1: R11.1 ; port 4MHZ_CLK
NetR11_2: R11.2 U11.5(PH0-OSC_IN)
NetR12_1: R12.1 ; port BATMS
NetU11_4: U11.4(PC15-OSC32_OUT) ; port DIAG_END
NetU11_14: U11.14(PA4) ; port ADC_RDY
NetU11_21: U11.21(PB10) ; port PD_ALM
NetU11_22: U11.22(PB11) ; port LED_ALM
NetU11_38: U11.38(PA15_(JTDI)) ; port INT_MAG

Not connected (* = marked no-connect by the designer): LCD11 1(NC) 14(NC); U11 1(VBAT) 6(PH1-OSC_OUT) 32(PA11) 36(VDDUSB) 42(PB6)

### Layout directives
net class SPI: SPI1_MISO, SPI1_MOSI, SPI1_SCK
net class UART: USART1_CLK, USART1_RX, USART1_TX
net class MCU_DEBUG: NRST, SWCLK, SWDIO, SWO
net class I2C: I2C1_SCL, I2C1_SDA
net class BOOTLOADER: BOOT
net class MCU_POWER: MCU_SUP
net class VDD_POWER: GND, MCU_SUP
mark named VDDA: GND, MCU_SUP

### Notes on the sheet
- AFE_PDN Active LOW
- SimpleWatch - Microcontroller
- Boning Dong

### Library data of the parts
C11 C12 C14 C15 C17-C20 = Cap: Capacitor; Published: 8-Jun-2000; LatestRevisionDate: 17-Jul-2002; LatestRevisionNote: Re-released for DXP Platform.; PackageReference: RAD-0.3; Publisher: Altium Limited; PackageDescription: Radial Cap, Thru-Hole; 2 Leads; 0.3 in Pin Spacing
P11 P15 = Header 2: Header, 2-Pin; LatestRevisionDate: 17-Jul-2002; LatestRevisionNote: Re-released for DXP Platform.; Publisher: Altium Limited
P12 = Header 4: Header, 4-Pin; LatestRevisionDate: 17-Jul-2002; LatestRevisionNote: Re-released for DXP Platform.; Publisher: Altium Limited
P13 P14 = Header 3: Header, 3-Pin; LatestRevisionDate: 17-Jul-2002; LatestRevisionNote: Re-released for DXP Platform.; Publisher: Altium Limited
P16 = Header 6: Header, 6-Pin; LatestRevisionDate: 17-Jul-2002; LatestRevisionNote: Re-released for DXP Platform.; Publisher: Altium Limited
R11 R12 R15-R19 R110 = Res1: Resistor; Published: 8-Jun-2000; LatestRevisionDate: 17-Jul-2002; LatestRevisionNote: Re-released for DXP Platform.; PackageReference: AXIAL-0.3; Publisher: Altium Limited; PackageDescription: Axial Device, Thru-Hole; 2 Leads; 0.3 in Pin Spacing
R13 R14 = Res1: Resistor; Value: ?R; Published: 8-Jun-2000; LatestRevisionDate: 17-Jul-2002; LatestRevisionNote: Re-released for DXP Platform.; PackageReference: AXIAL-0.3; Publisher: Altium Limited; PackageDescription: Axial Device, Thru-Hole; 2 Leads; 0.3 in Pin Spacing
SW11 SW12 = SW_TACT: General Tactile Switch
TP11 TP13 TP14 = TP_A: Test Point dot type
U11 = STM32L452CX: ARM® Cortex®-M4 STM32L4 Microcontroller IC 32-Bit 80MHz 512KB (512K x 8) FLASH 48-UFQFPN (7x7)

## Sheet SCH_4_Touch Sensors.SchDoc
size A
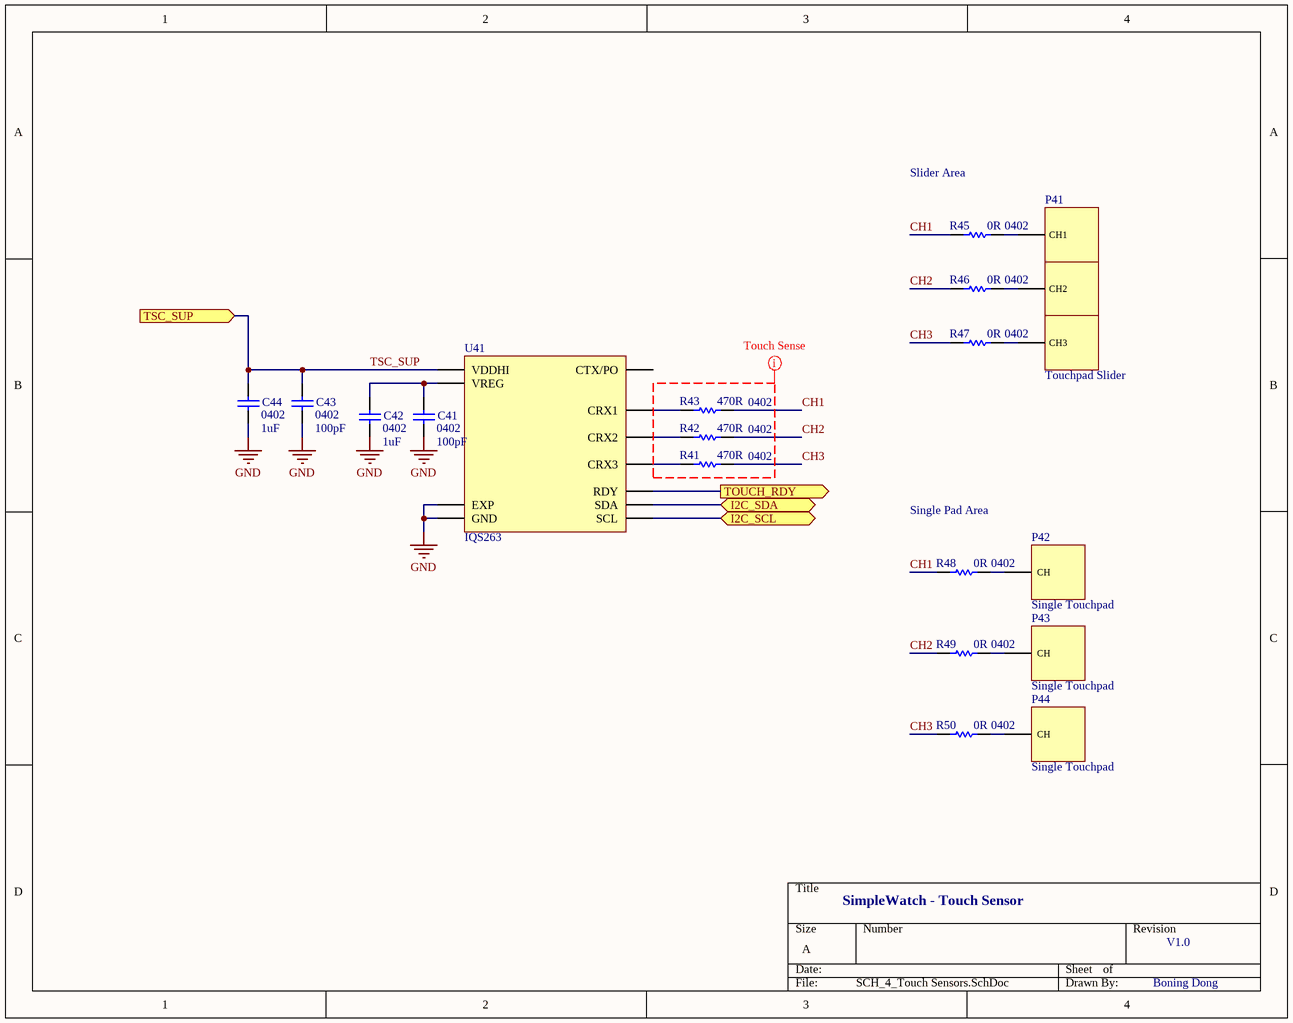
[diagram p4: SCH_4_Touch Sensors.SchDoc]

### Parts
C41  0402  value 100pF  [CAPC1005X07N]
C42  0402  value 1uF  [CAPC1005X07N]
C43  0402  value 100pF  [CAPC1005X07N]
C44  0402  value 1uF  [CAPC1005X07N]
P41  Touchpad Slider  [TPAD_SLIDER_21X7]
P42  Single Touchpad  [TPAD_8X8]
P43  Single Touchpad  [TPAD_8X8]
P44  Single Touchpad  [TPAD_8X8]
R41  0402  value 470R  [RESC1005X04N]
R42  0402  value 470R  [RESC1005X04N]
R43  0402  value 470R  [RESC1005X04N]
R45  0402  value 0R  [RESC1005X04N]
R46  0402  value 0R  [RESC1005X04N]
R47  0402  value 0R  [RESC1005X04N]
R48  0402  value 0R  [RESC1005X04N]
R49  0402  value 0R  [RESC1005X04N]
R50  0402  value 0R  [RESC1005X04N]
U41  IQS263  [DFN50P300X300-10N_HS240X150]

### Ports
I2C_SCL (bidir), I2C_SDA (bidir), TOUCH_RDY (out), TSC_SUP (in)

### Nets
GND: C41.1 C42.1 C43.1 C44.1 U41.1(GND) U41.11(EXP)
CH1: R43.2 R45.1 R48.1
CH2: R42.2 R46.1 R49.1
CH3: R41.2 R47.1 R50.1
I2C1_SCL: U41.8(SCL) ; port I2C_SCL
I2C1_SDA: U41.7(SDA) ; port I2C_SDA
TOUCH_RDY: U41.6(RDY) ; port TOUCH_RDY
TSC_SUP: C43.2 C44.2 U41.4(VDDHI) ; port TSC_SUP
NetC41_2: C41.2 C42.2 U41.5(VREG)
NetP41_1: P41.1(CH1) R45.2
NetP41_2: P41.2(CH2) R46.2
NetP41_3: P41.3(CH3) R47.2
NetP42_1: P42.1(CH) R48.2
NetP43_1: P43.1(CH) R49.2
NetP44_1: P44.1(CH) R50.2
NetR41_1: R41.1 U41.9(CRX3)
NetR42_1: R42.1 U41.3(CRX2)
NetR43_1: R43.1 U41.2(CRX1)

Not connected (* = marked no-connect by the designer): U41 10(CTX/PO)

### Layout directives
net class TOUCH_SENSE_CHANNEL: (no net found under the mark)

### Notes on the sheet
- Slider Area
- Single Pad Area
- SimpleWatch - Touch Sensor
- V1.0
- Boning Dong

### Library data of the parts
C41-C44 = Cap: Capacitor; Published: 8-Jun-2000; LatestRevisionDate: 17-Jul-2002; LatestRevisionNote: Re-released for DXP Platform.; PackageReference: RAD-0.3; Publisher: Altium Limited; PackageDescription: Radial Cap, Thru-Hole; 2 Leads; 0.3 in Pin Spacing
P41 = PAD_SLIDER_3CH: General Slider Touchpad
P42-P44 = PAD_SINGLE: General Single Touchpad
R41-R43 R45-R50 = Res1: Resistor; Published: 8-Jun-2000; LatestRevisionDate: 17-Jul-2002; LatestRevisionNote: Re-released for DXP Platform.; PackageReference: AXIAL-0.3; Publisher: Altium Limited; PackageDescription: Axial Device, Thru-Hole; 2 Leads; 0.3 in Pin Spacing
U41 = AZOTEQ_IQS263: 3 Channel Capacitive Touch Sensor. Capacitive Touch Buttons, Slider, Wheel 10-DFN (3x3)

## Sheet SCH_5_Vibration Motor.SchDoc
size A
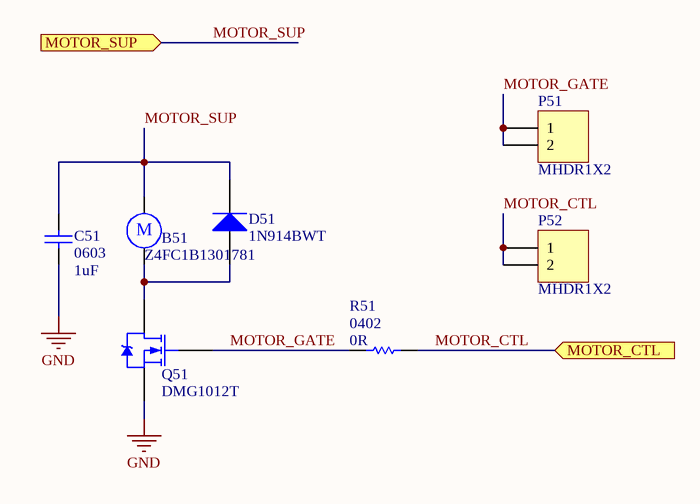
[diagram p5: SCH_5_Vibration Motor.SchDoc]

### Parts
B51  Z4FC1B1301781  [Z4FC1B1301781]
C51  0603  value 1uF  [CAPC1608X10N]
D51  1N914BWT  [SODFL160X70-2N]
P51  MHDR1X2  [MHDR1X2]
P52  MHDR1X2  [MHDR1X2]
Q51  DMG1012T  [SOT65P200X125X95-3N]
R51  0402  value 0R  [RESC1005X04N]

### Ports
MOTOR_CTL (in), MOTOR_SUP (in)

### Nets
GND: C51.1 Q51.2(S)
MOTOR_CTL: P52.1 P52.2 R51.2 ; port MOTOR_CTL  [project net MOTOR]
MOTOR_GATE: P51.1 P51.2 Q51.1(G) R51.1
MOTOR_SUP: B51.1 C51.2 D51.2(K) ; port MOTOR_SUP
NetB51_2: B51.2 D51.1(A) Q51.3(D)

### Notes on the sheet
- (in symbol Z4FC1B1301781) M

### Library data of the parts
B51 = Z4FC1B1301781: VIBRATION MOTOR CYL 2.7V SMD; Manufacturer: Jinlong Machinery & Electronics; RPM: 10000RPM; Supplier 1: Digi-Key; Manufacturer Part Number: Z4FC1B1301781; Stock 1: 7323; Pricing 1: 1=3.49, 5=3.302, 10=3.21, 25=3.1184, 50=2.843, 100=2.568, 250=2.4762, 500=2.4396 (USD); Min Operating Temperature: -20°C; Max Operating Temperature: 70°C; Termination: SMD/SMT
C51 = Cap: Capacitor; Published: 8-Jun-2000; LatestRevisionDate: 17-Jul-2002; LatestRevisionNote: Re-released for DXP Platform.; PackageReference: RAD-0.3; Publisher: Altium Limited; PackageDescription: Radial Cap, Thru-Hole; 2 Leads; 0.3 in Pin Spacing
D51 = 1N914BWT: DIODE GEN PURP 75V 200MA SOD523F; Manufacturer: ON Semiconductor / Fairchild; Peak Reverse Current: 5uA; Element Configuration: Single; Forward Current: 300mA; Forward Voltage: 1V; Reverse Recovery Time: 4ns; Power Dissipation: 200mW; Supplier 1: Digi-Key; Manufacturer Part Number: 1N914BWT; Stock 1: 39736; Pricing 1: 1=0.17, 10=0.159, 100=0.0866, 500=0.0533, 1000=0.0364 (USD); Mount: Surface Mount; Number of Pins: 2; Weight: 0.01g; Contact Plating: Tin,Matte; Min Operating Temperature: -55°C; Max Operating Temperature: 150°C; Max Repetitive Reverse Voltage (Vrrm): 75V; Package Quantity: 1; Packaging: Tape and Reel; Average Rectified Current: 200mA; Max Reverse Voltage (DC): 75V; Recovery Time: 4ns; Max Reverse Leakage Current: 5uA; Radiation Hardening: No; Lead Free: Lead Free; REACH SVHC: No SVHC; ComponentLink1URL: https://datasheet.ciiva.com/910/1n914bwt-910384.pdf; ComponentLink1Description: https://datasheet.ciiva.com/910/1n914bwt-910384.pdf; ComponentLink2URL: https://datasheet.ciiva.com/910/1n914bwt-910385.pdf; ComponentLink2Description: https://datasheet.ciiva.com/910/1n914bwt-910385.pdf; ComponentLink3URL: https://datasheet.ciiva.com/910/1n914bwt-910383.pdf; ComponentLink3Description: https://datasheet.ciiva.com/910/1n914bwt-910383.pdf; ComponentLink4URL: https://datasheet.ciiva.com/25953/1n4448wt-25953279.pdf; ComponentLink4Description: https://datasheet.ciiva.com/25953/1n4448wt-25953279.pdf
P51 P52 = MHDR1X2: Header, 2-Pin; LatestRevisionDate: 17-Jul-2002; LatestRevisionNote: Re-released for DXP Platform.; Publisher: Altium Limited
Q51 = DMG1012T-7: as Q31 on sheet SCH_3_Heartrate & Motion Sensors; Supplier 1: Digi-Key; Manufacturer Part Number: DMG1012T-7; Stock 1: 0; Pricing 1: 1=0.36, 10=0.326, 100=0.1824, 500=0.0977, 1000=0.0665 (USD); Mount: Surface Mount; Case/Package: SOT-523; Number of Pins: 3; Weight: 7.1E-05oz; Contact Plating: Tin,Matte; Min Operating Temperature: -55°C; Max Operating Temperature: 150°C; Continuous Drain Current (ID): 630mA; Packaging: Tape and Reel; Drain to Source Voltage (Vdss): 20V; Package Quantity: 3000; Number of Channels: 1; Drain to Source Breakdown Voltage: 20V; Power Dissipation: 280mW; On-State Resistance: 400MR; Length: 1.7mm; Height: 0.8mm; Width: 0.85mm; Radiation Hardening: No; REACH SVHC: No SVHC; Lead Free: Lead Free; ComponentLink1URL: https://datasheet.ciiva.com/934/ds31783-934512.pdf; ComponentLink1Description: https://datasheet.ciiva.com/934/ds31783-934512.pdf; ComponentLink2URL: https://datasheet.ciiva.com/4442/ds31783-44973-4442944.pdf; ComponentLink2Description: https://datasheet.ciiva.com/4442/ds31783-44973-4442944.pdf; ComponentLink3URL: https://datasheet.ciiva.com/11174/ds31783-11174965.pdf; ComponentLink3Description: https://datasheet.ciiva.com/11174/ds31783-11174965.pdf; ComponentLink4URL: https://datasheet.ciiva.com/17324/ds31783-17324010.pdf; ComponentLink4Description: https://datasheet.ciiva.com/17324/ds31783-17324010.pdf; ComponentLink5URL: https://datasheet.ciiva.com/6383/ds31783-6383803.pdf; ComponentLink5Description: https://datasheet.ciiva.com/6383/ds31783-6383803.pdf; ComponentLink6URL: https://datasheet.ciiva.com/934/ds31783-934511.pdf; ComponentLink6Description: https://datasheet.ciiva.com/934/ds31783-934511.pdf
R51 = Res1: Resistor; Published: 8-Jun-2000; LatestRevisionDate: 17-Jul-2002; LatestRevisionNote: Re-released for DXP Platform.; PackageReference: AXIAL-0.3; Publisher: Altium Limited; PackageDescription: Axial Device, Thru-Hole; 2 Leads; 0.3 in Pin Spacing

## Nets that join several sheets
APDS_SUP: SCH_3_Heartrate & Motion Sensors (C313.2 R39.2 U3.1), SCH_2_Battery & Power Management (R214.2)
GND: SCH_3_Heartrate & Motion Sensors (31 pins), SCH_2_Battery & Power Management (18 pins), SCH_1_Controller (25 pins), SCH_4_Touch Sensors (6 pins), SCH_5_Vibration Motor (C51.1 Q51.2)
LED_DRV_SUP: SCH_3_Heartrate & Motion Sensors (16 pins), SCH_2_Battery & Power Management (R212.2)
LSM303_SUP: SCH_3_Heartrate & Motion Sensors (C311.2 C312.2 U32.9 U32.10), SCH_2_Battery & Power Management (R213.2)
MCU_SUP: SCH_2_Battery & Power Management (R215.2), SCH_1_Controller (18 pins)
AFE_PDN: SCH_3_Heartrate & Motion Sensors (R38.1 U31.20), SCH_1_Controller (U11.18)
AFE_RST: SCH_3_Heartrate & Motion Sensors (R36.1 U31.29), SCH_1_Controller (U11.2)
APDS_LED: SCH_3_Heartrate & Motion Sensors (R310.1 R311.1), SCH_1_Controller (U11.19)
CS_AFE: SCH_3_Heartrate & Motion Sensors (U31.27), SCH_1_Controller (U11.3)
CS_MAG: SCH_3_Heartrate & Motion Sensors (U32.3), SCH_1_Controller (U11.26)
CS_XL: SCH_3_Heartrate & Motion Sensors (U32.2), SCH_1_Controller (U11.27)
I2C1_SCL: SCH_3_Heartrate & Motion Sensors (U32.1), SCH_1_Controller (P11.1 R19.2 TP14.1 U11.45), SCH_4_Touch Sensors (U41.8)
I2C1_SDA: SCH_3_Heartrate & Motion Sensors (U32.4), SCH_1_Controller (P11.2 R110.2 TP13.1 U11.46), SCH_4_Touch Sensors (U41.7)
INT1_ACC: SCH_3_Heartrate & Motion Sensors (U32.12), SCH_1_Controller (U11.28)
INT2_ACC: SCH_3_Heartrate & Motion Sensors (U32.11), SCH_1_Controller (U11.33)
MOTOR: SCH_1_Controller (U11.41), SCH_5_Vibration Motor (P52.1 P52.2 R51.2)
MOTOR_SUP: SCH_2_Battery & Power Management (C26.2 U22.5), SCH_5_Vibration Motor (B51.1 C51.2 D51.2)
NetR11_1: SCH_3_Heartrate & Motion Sensors (R37.1), SCH_1_Controller (R11.1)
NetR12_1: SCH_2_Battery & Power Management (R25.2 R26.1 TP21.1), SCH_1_Controller (R12.1)
NetU11_4: SCH_3_Heartrate & Motion Sensors (U31.21), SCH_1_Controller (U11.4)
NetU11_14: SCH_3_Heartrate & Motion Sensors (U31.28), SCH_1_Controller (U11.14)
NetU11_21: SCH_3_Heartrate & Motion Sensors (U31.23), SCH_1_Controller (U11.21)
NetU11_22: SCH_3_Heartrate & Motion Sensors (U31.22), SCH_1_Controller (U11.22)
NetU11_38: SCH_3_Heartrate & Motion Sensors (U32.7), SCH_1_Controller (U11.38)
OPAMP1_VINP: SCH_3_Heartrate & Motion Sensors (TP37.1 U3.6), SCH_1_Controller (U11.10)
SPI1_MISO: SCH_3_Heartrate & Motion Sensors (U31.25), SCH_1_Controller (P14.2 U11.16)
SPI1_MOSI: SCH_3_Heartrate & Motion Sensors (U31.26), SCH_1_Controller (LCD11.8 P14.3 U11.17)
SPI1_SCK: SCH_3_Heartrate & Motion Sensors (U31.24), SCH_1_Controller (LCD11.9 P14.1 U11.15)
TOUCH_RDY: SCH_1_Controller (U11.25), SCH_4_Touch Sensors (U41.6)
TSC_SUP: SCH_2_Battery & Power Management (R211.2), SCH_4_Touch Sensors (C43.2 C44.2 U41.4)